# EAGLE design signal-a-2 (EAGLE 9.6.2)
AUTHOR: Balazs Racz; DRAWING_TITLE: MEB Schalterwerk Projekt; LICENSE: Licensed by the Solderpad Hardware License V2.0; REVIEWER: n/a; REVISION: A2; YEAR: 2023
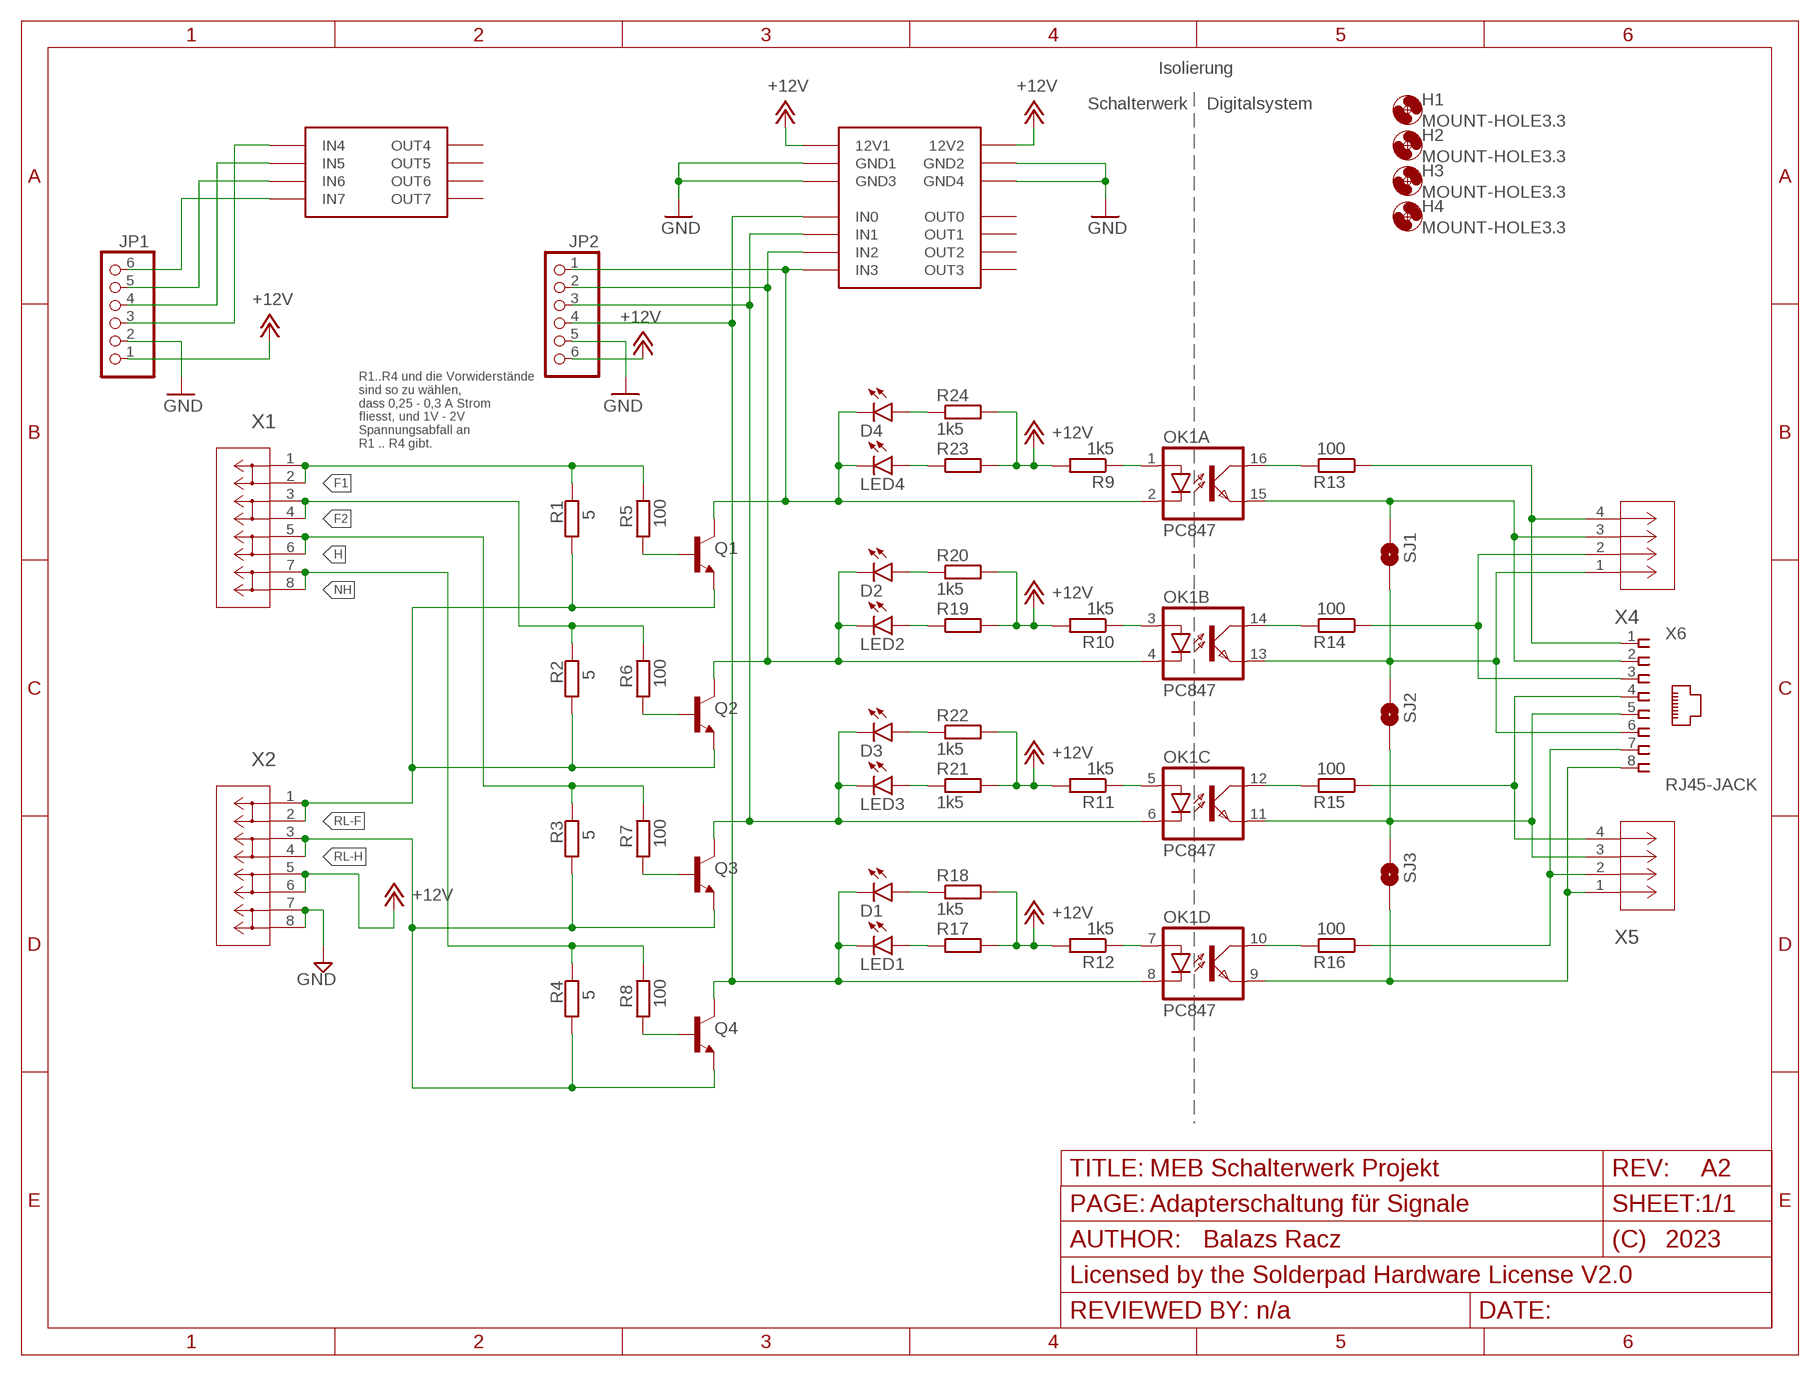
[diagram p0: schematic, sheet 1]
FRAME1 (FRAME_A_L): PAGE: Input ports
FRAME2 (FRAME_A_L): PAGE: Adapterschaltung für Signale

## Parts
D1  LEDHEADER  [LEDHEADER]
D2  LEDHEADER  [LEDHEADER]
D3  LEDHEADER  [LEDHEADER]
D4  LEDHEADER  [LEDHEADER]
H1  MOUNT-HOLE3.3  [3,3]
H2  MOUNT-HOLE3.3  [3,3]
H3  MOUNT-HOLE3.3  [3,3]
H4  MOUNT-HOLE3.3  [3,3]
JP1  PINHD-1X6-EDGE  [1X06]
JP2  PINHD-1X6-EDGE  [1X06]
LED1  LEDCHIPLED_0603  [CHIPLED_0603]
LED2  LEDCHIPLED_0603  [CHIPLED_0603]
LED3  LEDCHIPLED_0603  [CHIPLED_0603]
LED4  LEDCHIPLED_0603  [CHIPLED_0603]
OK1  PC847  [DIL16]
Q1  NPN-23  [SOT23]
Q2  NPN-23  [SOT23]
Q3  NPN-23  [SOT23]
Q4  NPN-23  [SOT23]
R1  5  R-EU_0617/22  [0617/22]
R2  5  R-EU_0617/22  [0617/22]
R3  5  R-EU_0617/22  [0617/22]
R4  5  R-EU_0617/22  [0617/22]
R5  100  R-EU_R0805  [R0805]
R6  100  R-EU_R0805  [R0805]
R7  100  R-EU_R0805  [R0805]
R8  100  R-EU_R0805  [R0805]
R9  1k5  R-EU_R0805  [R0805]
R10  1k5  R-EU_R0805  [R0805]
R11  1k5  R-EU_R0805  [R0805]
R12  1k5  R-EU_R0805  [R0805]
R13  100  R-EU_R0805  [R0805]
R14  100  R-EU_R0805  [R0805]
R15  100  R-EU_R0805  [R0805]
R16  100  R-EU_R0805  [R0805]
R17  1k5  R-EU_R0805  [R0805]
R18  1k5  R-EU_R0805  [R0805]
R19  1k5  R-EU_R0805  [R0805]
R20  1k5  R-EU_R0805  [R0805]
R21  1k5  R-EU_R0805  [R0805]
R22  1k5  R-EU_R0805  [R0805]
R23  1k5  R-EU_R0805  [R0805]
R24  1k5  R-EU_R0805  [R0805]
SJ1  SJRND2  [SJ_RND2]
SJ2  SJRND2  [SJ_RND2]
SJ3  SJRND2  [SJ_RND2]
X1  PHNX_4P_508CONN_1017493  [PHNX_4P_508]
X2  PHNX_4P_508CONN_1017493  [PHNX_4P_508]
X3  IO-HAT  [IOBOARD]
X4  PHNX_4P_350CONN_1984989_PXC  [PHNX_4P_350]
X5  PHNX_4P_350CONN_1984989_PXC  [PHNX_4P_350]
X6  RJ45-JACK  RJ45-JACKRJ45-PULSE-E5J00  [RJ45-PULSE-E5J88]

## Nets
+12V: JP1.1 JP2.6 R9.2 R10.2 R11.2 R12.2 R17.2 R18.2 R19.2 R20.2 R21.2 R22.2 R23.2 R24.2 X2.5 X2.6 X3.P$1(12V1) X3.P$22(12V2)
F1: R1.1 R5.2 X1.1 X1.2
F2: R2.1 R6.2 X1.3 X1.4
GND: JP1.2 JP2.5 X2.7 X2.8 X3.P$2(GND1) X3.P$11(GND3) X3.P$12(GND4) X3.P$21(GND2)
H: R3.1 R7.2 X1.5 X1.6
N$1: JP1.6 X3.P$10(IN7)
N$2: D1.C JP2.4 LED1.C OK1.8(D:C) Q4.3(C) X3.P$3(IN0)
N$3: JP1.5 X3.P$9(IN6)
N$4: JP1.4 X3.P$8(IN5)
N$5: D3.C JP2.3 LED3.C OK1.6(C:C) Q3.3(C) X3.P$4(IN1)
N$6: JP1.3 X3.P$7(IN4)
N$7: D2.C JP2.2 LED2.C OK1.4(B:C) Q2.3(C) X3.P$5(IN2)
N$8: LED1.A R17.1
N$9: D4.C JP2.1 LED4.C OK1.2(A:C) Q1.3(C) X3.P$6(IN3)
N$21: D1.A R18.1
N$22: Q1.1(B) R5.1
N$23: LED2.A R19.1
N$24: D2.A R20.1
N$25: LED3.A R21.1
N$27: D3.A R22.1
N$29: LED4.A R23.1
N$30: D4.A R24.1
N$31: OK1.1(A:A) R9.1
N$32: Q2.1(B) R6.1
N$34: OK1.3(B:A) R10.1
N$35: OK1.5(C:A) R11.1
N$36: OK1.7(D:A) R12.1
N$37: Q3.1(B) R7.1
N$39: Q4.1(B) R8.1
N$41: OK1.16(A:COL) R13.2
N$42: OK1.14(B:COL) R14.2
N$43: OK1.12(C:COL) R15.2
N$44: OK1.10(D:COL) R16.2
NH: R4.1 R8.2 X1.7 X1.8
NX41: R13.1 X4.4 X6.1
NX42: OK1.15(A:EMIT) SJ1.P$2 X4.3 X6.2
NX43: R14.1 X4.2 X6.3
NX44: R15.1 X5.4 X6.4
NX45: OK1.11(C:EMIT) SJ2.P$1 SJ3.P$2 X5.3 X6.5
NX46: OK1.13(B:EMIT) SJ1.P$1 SJ2.P$2 X4.1 X6.6
NX47: R16.1 X5.2 X6.7
NX48: OK1.9(D:EMIT) SJ3.P$1 X5.1 X6.8
RL-F: Q1.2(E) Q2.2(E) R1.2 R2.2 X2.1 X2.2
RL-H: Q3.2(E) Q4.2(E) R3.2 R4.2 X2.3 X2.4
Unconnected: X3.P$13(OUT7) X3.P$14(OUT6) X3.P$15(OUT5) X3.P$16(OUT4) X3.P$17(OUT3) X3.P$18(OUT2) X3.P$19(OUT1) X3.P$20(OUT0)

## Notes on the sheet
- Isolierung
- Schalterwerk | Digitalsystem
- R1..R4 und die Vorwiderstände
  sind so zu wählen,
  dass 0,25 - 0,3 A Strom
  fliesst, und 1V - 2V
  Spannungsabfall an
  R1 .. R4 gibt.

## Library data of the parts
D1-D4 = eagleparts:LEDHEADER
H1-H4 = holes:MOUNT-HOLE: MOUNTING HOLE with drill center marker
JP1 JP2 = eagleparts:PINHD-1X6-EDGE: PIN HEADER
LED1-LED4 = led:LED: LED OSRAM: - CHIPLED LG R971, LG N971, LY N971, LG Q971, LY Q971, LO R971, LY R971 LH N974, LH R974 LS Q976, LO Q976, LY Q976 LO Q996 - Hyper CHIPLED LW Q18S LB Q993, LB Q99A, LB R99A - SideLED LS A670, LO A670, LY A670, LG A670, LP A670 LB A673, LV A673, LT A673, LW A673 LH A674 LY A675 LS A676, LA A676, LO A676, LY A676, LW A676 LS A679, LY A679, LG A679 - Hyper Micro SIDELED® LS Y876, LA Y876, LO Y876, LY Y876 LT Y87S - SmartLED LW L88C, LW L88S LB L89C, LB L89S, LG L890 LS L89K, LO L89K, LY L89K LS L896, LA L896, LO L896, LY L896 - TOPLED LS T670, LO T670, LY T670, LG T670, LP T670 LSG T670, LSP T670, LSY T670, LOP T670, LYG T670 LG T671, LOG T671, LSG T671 LB T673, LV T673, LT T673, LW T673 LH T674 LS T676, LA T676, LO T676, LY T676, LB T676, LH T676, LSB T676, LW T676 LB T67C, LV T67C, LT T67C, LS T67K, LO T67K, LY T67K, LW E67C LS E67B, LA E67B, LO E67B, LY E67B, LB E67C, LV E67C, LT E67C LW T67C LS T679, LY T679, LG T679 LS T770, LO T770, LY T770, LG T770, LP T770 LB T773, LV T773, LT T773, LW T773 LH T774 LS E675, LA E675, LY E675, LS T675 LS T776, LA T776, LO T776, LY T776, LB T776 LHGB T686 LT T68C, LB T68C - Hyper Mini TOPLED® LB M676 - Mini TOPLED Santana® LG M470 LS M47K, LO M47K, LY M47K Source: http://www.osram.convergy.de LUXEON: - LUMILED® LXK2-PW12-R00, LXK2-PW12-S00, LXK2-PW14-U00, LXK2-PW14-V00 LXK2-PM12-R00, LXK2-PM12-S00, LXK2-PM14-U00 LXK2-PE12-Q00, LXK2-PE12-R00, LXK2-PE12-S00, LXK2-PE14-T00, LXK2-PE14-U00 LXK2-PB12-K00, LXK2-PB12-L00, LXK2-PB12-M00, LXK2-PB14-N00, LXK2-PB14-P00, LXK2-PB14-Q00 LXK2-PR12-L00, LXK2-PR12-M00, LXK2-PR14-Q00, LXK2-PR14-R00 LXK2-PD12-Q00, LXK2-PD12-R00, LXK2-PD12-S00 LXK2-PH12-R00, LXK2-PH12-S00 LXK2-PL12-P00, LXK2-PL12-Q00, LXK2-PL12-R00 Source: www.luxeon.com KINGBRIGHT: KA-3528ASYC Source: www.kingbright.com
OK1 = optocoupler:PC847: SHARP OPTO COUPLER; OC_FARNELL: 9707735; OC_NEWARK: unknown
Q1-Q4 = eagleparts:NPN-23
R1-R24 = rcl:R-EU_: RESISTOR, European symbol; SPICEPREFIX: R
SJ1-SJ3 = eagleparts:SJ: SMD solder JUMPER
X1 X2 = eagleparts:PHNX_4P_508: https://www.digikey.com/en/products/detail/phoenix-contact/1017505/9346606 DigiKey 277-17516-ND; COPYRIGHT: Copyright (C) 2023 Ultra Librarian. All rights reserved.; MANUFACTURER_PART_NUMBER: 1017505; MFR_NAME: Phoenix Contact
X3 = eagleparts:IO-HAT
X4 X5 = eagleparts:PHNX_4P_350: https://www.digikey.com/en/products/detail/phoenix-contact/1984989/2513979 DigiKey 277-6404-ND; COPYRIGHT: Copyright (C) 2023 Ultra Librarian. All rights reserved.; MANUFACTURER_PART_NUMBER: 1984989; MFR_NAME: Phoenix Contact
X6 = trainlib:RJ45-JACK: Mod. Jack, Right Angle, 8 posiotion, 8 contatcs RJ45 Source: GLX-S-88M.pdf

## Board
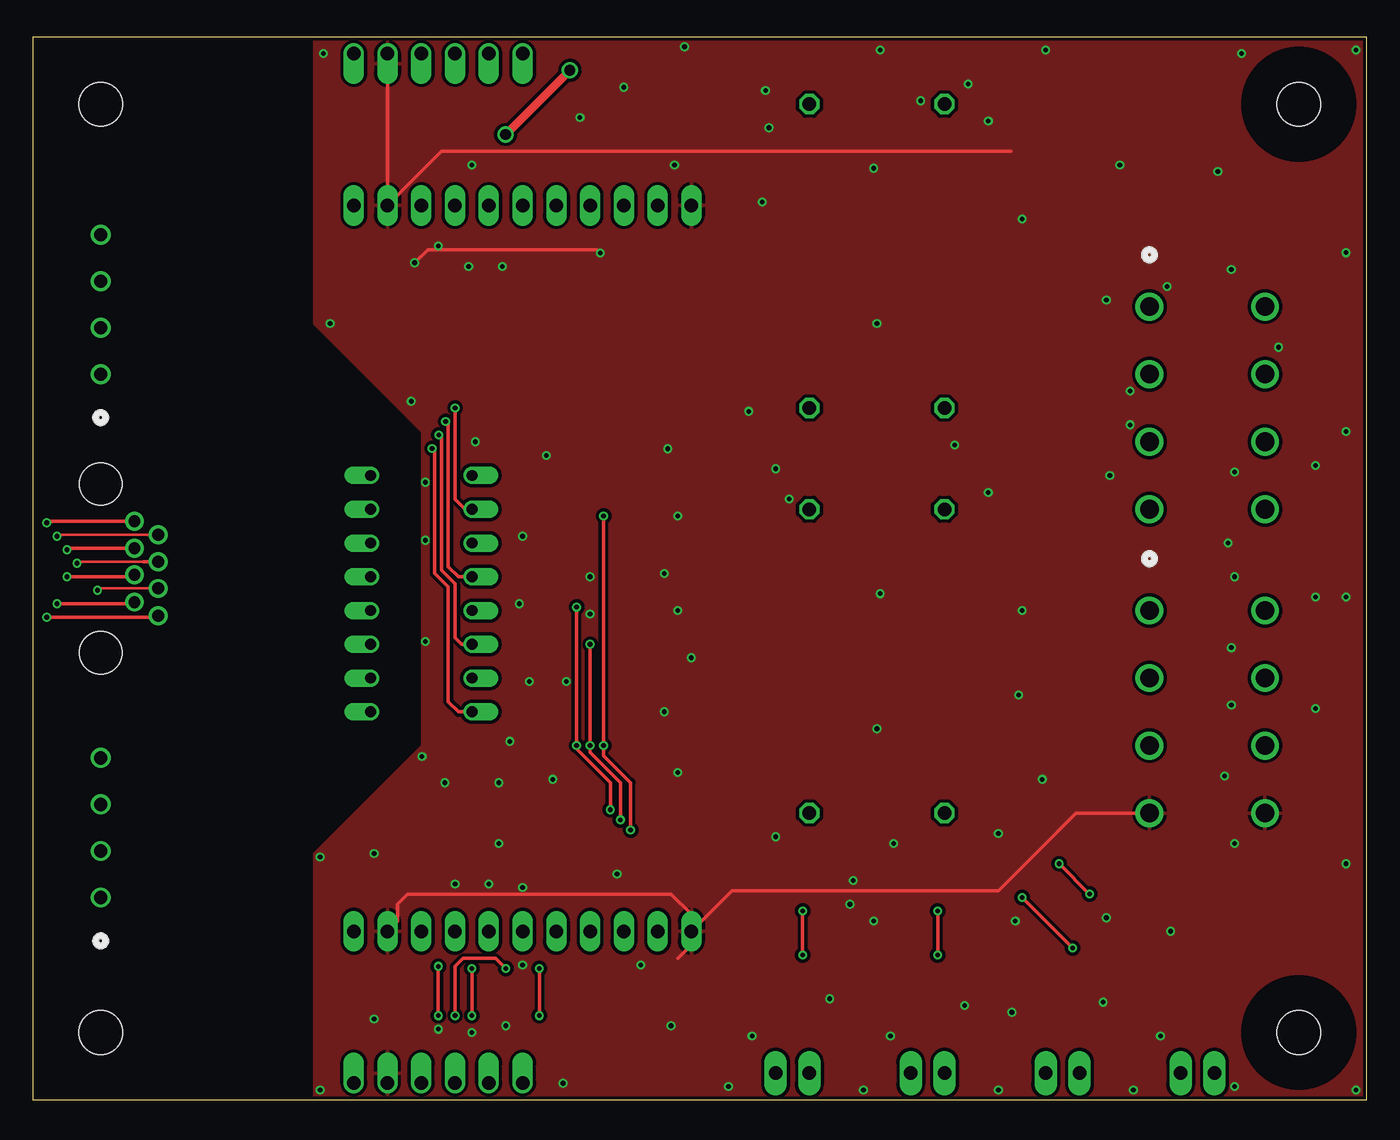
[diagram p1: board, top side]
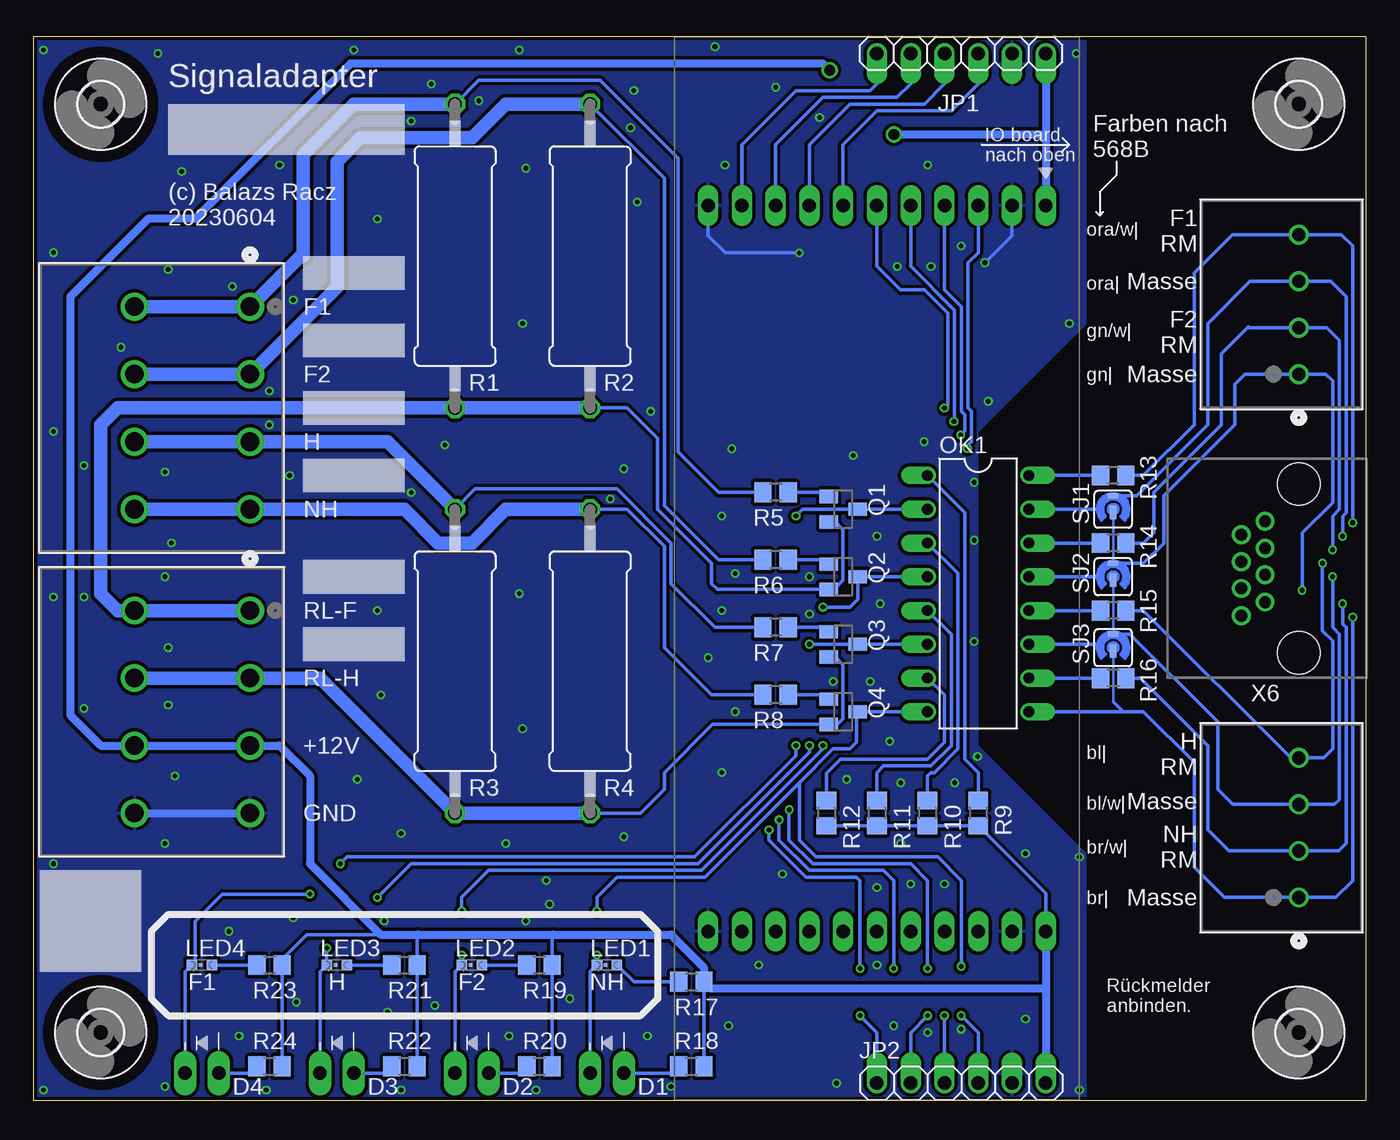
[diagram p2: board, bottom side, seen from below]

Size 100.33 x 80.01 mm. Coordinates in mm from the lower left corner, seen from the top.
Outline: 100.33,0 0,0 0,80.01 100.33,80 100.33,0
Copper layers (1*16): Top 0.035mm / dielectric 1.5mm / Bottom 0.035mm
Design rules "SeeedStudio_2layer_DRU_no_angle_20140221": minimum track width 6mil, minimum drill 12mil, track to track 6mil, track to pad 6mil, pad to pad 6mil, via to via 6mil, smd to smd 0mil, copper to edge 10mil, drill to drill 10mil, minimum pad ring 10mil, minimum via ring 6mil, stop-mask expansion 2mil, vias tented up to drill 100mil, thermal gap 10mil

### Footprints (pad centres in the part's own frame; a part is rotated, then mirrored left to right if it is on the bottom)
LEDHEADER = drill 1.016 pad 1.676 long: A -1.27,0; C 1.27,0
3,3 = hole 3.3: 0,0
1X06 = drill 1.016 offset: 1 -6.35,0; 2 -3.81,0; 3 -1.27,0; 4 1.27,0; 5 3.81,0; 6 6.35,0
CHIPLED_0603 = smd 0.8 x 0.8: A 0,-0.75; C 0,0.75
DIL16 = drill 0.813 offset: 1 -8.89,-3.81; 2 -6.35,-3.81; 3 -3.81,-3.81; 4 -1.27,-3.81; 5 1.27,-3.81; 6 3.81,-3.81; 7 6.35,-3.81; 8 8.89,-3.81; 9 8.89,3.81; 10 6.35,3.81; 11 3.81,3.81; 12 1.27,3.81; 13 -1.27,3.81; 14 -3.81,3.81; 15 -6.35,3.81; 16 -8.89,3.81
SOT23 = smd 1 x 1.4: 1 -0.95,-1.1; 2 0.95,-1.1; 3 0,1.1
0617/22 = drill 1.016 octagon: 1 -11.43,0; 2 11.43,0
R0805 = smd 1.3 x 1.5: 1 -0.95,0; 2 0.95,0
SJ_RND2 = smd 1.016 x 0.508: P$1 -0.254,0 | smd 0.406 x 0.813: P$2 1.016,0
PHNX_4P_508 = drill 1.397 pad 1.905: 1 -15.24,8.7; 2 -15.24,0; 3 -10.16,8.7; 4 -10.16,0; 5 -5.08,8.7; 6 -5.08,0; 7 0,8.7; 8 0,0
IOBOARD = drill 1.016 pad 1.524 long: P$1 12.7,27.94; P$2 12.7,25.4; P$3 12.7,22.86; P$4 12.7,20.32; P$5 12.7,17.78; P$6 12.7,15.24; P$7 12.7,12.7; P$8 12.7,10.16; P$9 12.7,7.62; P$10 12.7,5.08; P$11 12.7,2.54; P$12 67.31,2.54; P$13 67.31,5.08; P$14 67.31,7.62; P$15 67.31,10.16; P$16 67.31,12.7; P$17 67.31,15.24; P$18 67.31,17.78; P$19 67.31,20.32; P$20 67.31,22.86; P$21 67.31,25.4; P$22 67.31,27.94
PHNX_4P_350 = drill 0.991 pad 1.499: 1 0,0; 2 3.5,0; 3 7,0; 4 10.5,0
RJ45-PULSE-E5J88 = drill 0.9 pad 1.422: 1 3.555,2.54; 2 2.535,4.32; 3 1.515,2.54; 4 0.495,4.32; 5 -0.495,2.54; 6 -1.515,4.32; 7 -2.535,2.54; 8 -3.555,4.32 | hole 3.2: 6.35,0; -6.35,0

### Placement (x,y rotation side)
D1  57.15,2.02 180 bottom
D2  67.31,2.02 180 bottom
D3  77.47,2.02 180 bottom
D4  87.63,2.02 180 bottom
H1  5.08,74.93 0 bottom
H2  5.08,5.08 0 bottom
H3  95.25,5.08 0 bottom
H4  95.25,74.93 0 bottom
JP1  30.48,78.74 180 bottom
JP2  30.48,1.27 0 bottom
LED1  57.15,10.16 90 bottom
LED2  67.31,10.16 90 bottom
LED3  77.47,10.16 90 bottom
LED4  87.63,10.16 90 bottom
OK1  29.21,38.1 270 bottom
Q1  39.37,44.45 270 bottom
Q2  39.37,39.37 270 bottom
Q3  39.37,34.29 270 bottom
Q4  39.37,29.21 270 bottom
R1  68.58,63.5 270 bottom
R2  58.42,63.5 270 bottom
R3  68.58,33.02 270 bottom
R4  58.42,33.02 270 bottom
R5  44.45,45.72 180 bottom
R6  44.45,40.64 180 bottom
R7  44.45,35.56 180 bottom
R8  44.45,30.48 180 bottom
R9  29.21,21.59 270 bottom
R10  33.02,21.59 270 bottom
R11  36.83,21.59 270 bottom
R12  40.64,21.59 270 bottom
R13  19.05,46.99 180 bottom
R14  19.05,41.91 180 bottom
R15  19.05,36.83 180 bottom
R16  19.05,31.75 180 bottom
R17  50.8,8.89 0 bottom
R18  50.8,2.54 0 bottom
R19  62.23,10.16 0 bottom
R20  62.23,2.54 0 bottom
R21  72.39,10.16 0 bottom
R22  72.39,2.54 0 bottom
R23  82.55,10.16 0 bottom
R24  82.55,2.54 0 bottom
SJ1  19.05,44.45 90 bottom
SJ2  19.05,39.37 90 bottom
SJ3  19.05,34.04 90 bottom
X1  92.71,44.45 270 bottom
X2  92.71,21.59 270 bottom
X3  52.07,80.01 270 bottom
X4  5.08,54.61 90 bottom
X5  5.08,15.24 90 bottom
X6  5.08,40.01 90 bottom

### Tracks (layer width: path | path; a pad name or v marks a point on that pad's centre or on a via)
+12V  (via drill 0.81)
  Top 0.61: v35.56,72.64 v40.39,77.47
  Bottom 0.254: R24.2 R23.2 81.6,10.6 79.76,12.45 74.17,12.45 | R20.2 R19.2 61.28,12.38 61.21,12.45 | R22.2 R21.2 71.44,12.38 71.37,12.45 | R17.2 R18.2 | R12.2 R11.2 R10.2 R9.2 24.13,15.56 X3.P$22
  Bottom 0.61: 24.13,8.38 49.34,8.38 R17.2 49.85,9.97 52.32,12.45 61.21,12.45 71.37,12.45 74.17,12.45 79.5,17.78 79.5,24.38 81.79,26.67 X2.5 X2.6 95.25,26.67 97.54,28.96 97.54,60.45 91.69,66.29 88.14,66.29 76.45,77.98 40.89,77.98 v40.39,77.47 | JP1.1 24.13,72.64 | 24.13,72.64 X3.P$1 | 24.13,72.64 v35.56,72.64 | 24.13,8.38 JP2.6 | X3.P$22 24.13,8.38
F1
  Bottom 0.254: R5.2 48.77,45.72 51.82,48.77 51.82,70.87 57.66,76.71 66.8,76.71 R1.1
  Bottom 1.016: X1.2 X1.1 80.2,63.5 80.01,63.5 80.01,71.12 76.2,74.93 R1.1
F2
  Bottom 0.254: R2.1 52.83,69.34 52.83,44.7 48.77,40.64 R6.2
  Bottom 1.016: X1.4 X1.3 77.47,61.15 77.47,70.61 75.69,72.39 67.31,72.39 64.77,74.93 R2.1
GND  (via drill 0.35)
  Top 0.254: 73.6,71.37 30.73,71.37 X3.P$2 JP1.2 | v42.67,63.74 42.42,63.99 29.7,63.99 v28.7,62.99 | X2.7 78.49,21.59 72.64,15.75 52.58,15.75 X3.P$12 | X3.P$12 49.53,11.68 48.51,10.67 | X3.P$21 27.43,13.46 27.43,14.73 28.19,15.49 48.01,15.49 49.53,13.97 X3.P$12
  Bottom 0.254: X3.P$2 26.67,65.02 v28.7,62.99 | X3.P$11 49.53,65.02 48.24,63.74 v42.67,63.74
  Bottom 0.61: X2.8 X2.7
  other vias: 90.93,78.74 89.15,69.85 76.2,78.99 63.75,78.99 49.02,79.25 44.45,76.2 33.02,70.36 48.26,70.36 21.84,78.74 41.15,73.91 82.55,50.8 35.88,26.99 35.05,19.3 61.47,14.73 63.25,13.46 73.91,13.46 80.77,13.72 85.6,12.7 90.42,19.3 84.84,4.83 73.66,6.6 80.52,7.37 70.1,7.11 64.52,4.83 59.94,7.62 54.1,4.83 48.01,5.59 61.72,16.51 35.56,5.59 39.88,1.27 25.65,6.1 25.65,18.54 89.66,24.38 90.17,29.72 90.17,34.04 90.42,39.37 90.42,47.24 93.73,56.64 90.17,62.48 81.79,70.36 80.77,60.2 85.34,61.21 35.05,23.88 39.12,24.13 30.99,23.88 37.34,31.5 36.58,37.34 36.83,42.42 48.51,43.94 47.5,39.62 41.91,39.37 41.91,36.58 48.51,36.83 49.53,33.27 40.13,31.5 47.5,29.21 63.75,38.1 63.5,27.94 55.88,47.5 69.34,49.28 71.88,45.72 81.03,46.99 74.17,30.48 74.42,36.83 89.92,41.91 75.95,24.13 72.64,20.07 55.88,19.81 64.77,19.3 48.51,24.64 43.94,17.02 45.72,10.16 28.45,52.58 22.35,58.42 33.27,49.53 29.51,46.48 29.51,42.11 29.51,34.49 29.26,25.86 21.59,18.29 21.59,0.76 52.32,1.02 62.48,0.76 72.64,0.76 82.8,0.76 90.42,1.02 99.57,0.76 98.81,17.78 98.81,37.85 98.81,50.29 98.81,63.75 99.57,78.99 74.42,66.29 63.25,70.1 63.5,58.42 82.55,53.34 53.85,51.82 54.86,67.56 47.75,49.01 38.61,48.5 33.02,5.08 30.48,5.33 36.83,16 34.29,16.26 31.75,16.26 36.83,10.16 70.36,76.45 66.8,75.18 55.12,75.95 96.52,37.85 96.52,47.75 96.52,29.46 56.9,45.21 55.37,73.15 71.88,73.66 35.31,62.72 32.77,62.72 30.48,64.25
  pour Bottom (isolate 0.254): 100.08,79.76 100.08,0.25 21.08,0.25 21.08,18.54 29.21,26.67 29.21,50.29 21.08,58.42 21.08,79.76
  pour Top (isolate 0.254): 100.08,0.25 100.08,79.76 21.08,79.76 21.08,58.42 29.21,50.29 29.21,26.67 21.08,18.54 21.08,0.25
H
  Bottom 0.254: R3.1 67.06,45.97 56.39,45.97 52.32,41.91 52.32,38.86 49.02,35.56 R7.2
  Bottom 1.016: X1.6 X1.5 73.66,49.53 R3.1
N$1
  Bottom 0.254: X3.P$10 46.99,71.88 42.93,75.95 37.34,75.95 36.83,76.45 JP1.6
N$2  (via drill 0.35)
  Top 0.254: v30.02,49.02 30.23,48.82 30.23,39.62 31.24,38.61 31.24,29.97 32,29.21 OK1.8 | v57.91,14.22 v57.91,10.92 | v30.48,10.06 v30.48,6.35
  Bottom 0.254: X3.P$3 29.21,63.75 29.97,62.99 29.97,52.07 29.72,51.82 29.72,49.53 30.02,49.23 v30.02,49.02 | LED1.C 57.91,10.15 | 57.91,10.15 58.42,9.64 D1.C | OK1.8 Q4.3 38.35,29.13 38.35,26.92 38.86,26.42 40.13,26.42 42.67,23.88 | v57.91,14.22 57.91,15.24 56.39,16.76 49.78,16.76 42.67,23.88 | v57.91,10.92 57.91,10.15 | 42.67,23.88 42.67,19.56 41.4,18.29 32.26,18.29 30.48,16.51 v30.48,10.06 | v30.48,6.35 29.21,5.08 JP2.4
N$3
  Bottom 0.254: X3.P$9 44.45,71.88 40.89,75.44 35.31,75.44 34.29,76.45 JP1.5
N$4
  Bottom 0.254: X3.P$8 41.91,71.88 38.86,74.93 33.27,74.93 31.75,76.45 JP1.4
N$5  (via drill 0.35)
  Top 0.254: OK1.6 32.26,34.29 31.75,34.8 31.75,38.86 30.73,39.88 30.73,49.84 v30.53,50.04 | v78.23,11.43 v74.42,15.24 | v41.91,34.29 v41.91,26.67 41.91,26.16 44.2,23.88 v44.2,21.08 | v31.75,6.35 31.75,10.06 32.36,10.67 34.8,10.67 v35.56,9.91
  Bottom 0.254: X3.P$4 31.75,60.96 30.48,59.69 30.48,51.82 30.23,51.56 30.23,50.34 v30.53,50.04 | D3.C 78.74,9.64 LED3.C 78.23,10.17 v78.23,11.43 | OK1.6 Q3.3 v41.91,34.29 | v74.42,15.24 71.88,17.78 50.29,17.78 41.91,26.16 v41.91,26.67 | JP2.3 v31.75,6.35 | v44.2,21.08 44.2,19.56 41.91,17.27 36.32,17.27 35.56,16.51 v35.56,9.91
N$6
  Bottom 0.254: X3.P$7 39.37,71.88 36.83,74.42 31.24,74.42 29.21,76.45 JP1.3
N$7  (via drill 0.35)
  Top 0.254: v31.04,51.05 31.24,50.85 31.24,40.13 32,39.37 OK1.4 | v68.07,10.92 v68.07,14.22 | v40.89,37.08 v40.89,26.67 40.89,26.42 43.43,23.88 v43.43,21.84 | v33.02,6.35 v33.02,9.91
  Bottom 0.254: X3.P$5 34.29,62.74 30.99,59.44 30.99,51.1 v31.04,51.05 | D2.C 68.58,9.64 LED2.C v68.06,10.91 v68.07,10.92 | OK1.4 Q2.3 38.27,37.68 38.86,37.08 v40.89,37.08 | v68.07,14.22 68.07,15.24 66.04,17.27 50.04,17.27 40.89,26.42 v40.89,26.67 | JP2.2 34.29,5.08 v33.02,6.35 | v33.02,9.91 33.02,16.51 34.29,17.78 41.66,17.78 43.43,19.56 v43.43,21.84
N$8
  Bottom 0.254: R17.1 55.13,8.89 LED1.A
N$9  (via drill 0.35)
  Top 0.254: v31.75,52.07 31.75,45.21 32.51,44.45 OK1.2 | v79.5,15.49 v77.22,17.78 | v42.93,43.94 v42.93,26.67 42.93,25.91 44.96,23.88 v44.96,20.32 | v38.1,9.91 v38.1,6.35
  Bottom 0.254: X3.P$6 36.83,62.74 35.05,60.96 33.27,60.96 31.5,59.18 31.5,52.32 v31.75,52.07 | D4.C 88.9,9.64 LED4.C 88.14,10.4 88.14,13.46 86.11,15.49 v79.5,15.49 | OK1.2 Q1.3 42.42,44.45 v42.93,43.94 | v77.22,17.78 76.71,18.29 50.55,18.29 42.93,25.91 v42.93,26.67 | JP2.1 36.83,5.08 v38.1,6.35 | v38.1,9.91 38.1,16.51 38.35,16.76 42.16,16.76 44.96,19.56 v44.96,20.32
N$21
  Bottom 0.254: R18.1 52.27,2.02 D1.A
N$22
  Bottom 0.254: R5.1 40.79,45.72 Q1.1
N$23
  Bottom 0.254: R19.1 LED2.A
N$24
  Bottom 0.254: R20.1 63.7,2.02 D2.A
N$25
  Bottom 0.254: R21.1 LED3.A
N$27
  Bottom 0.254: R22.1 73.86,2.02 D3.A
N$29
  Bottom 0.254: R23.1 LED4.A
N$30
  Bottom 0.254: R24.1 84.02,2.02 D4.A
N$31
  Bottom 0.254: OK1.1 30.23,44.2 30.23,25.65 29.21,24.64 R9.1
N$32
  Bottom 0.254: R6.1 40.79,40.64 Q2.1
N$34
  Bottom 0.254: R10.1 33.02,24.38 32.77,24.64 32.51,24.64 30.73,26.42 30.73,39.62 OK1.3
N$35
  Bottom 0.254: R11.1 36.83,24.64 36.32,25.15 32.77,25.15 31.24,26.67 31.24,35.05 OK1.5
N$36
  Bottom 0.254: R12.1 40.64,24.57 39.56,25.65 33.02,25.65 31.75,26.92 31.75,30.48 OK1.7
N$37
  Bottom 0.254: R7.1 40.79,35.56 Q3.1
N$39
  Bottom 0.254: R8.1 40.79,30.48 Q4.1
N$41
  Bottom 0.254: R13.2 OK1.16
N$42
  Bottom 0.254: R14.2 OK1.14
N$43
  Bottom 0.254: R15.2 OK1.12
N$44
  Bottom 0.254: R16.2 OK1.10
NH
  Bottom 0.254: R4.1 55.63,44.45 52.83,41.66 52.83,34.04 49.28,30.48 R8.2
  Bottom 1.016: X1.8 X1.7 72.39,44.45 69.85,41.91 67.31,41.91 64.77,44.45 R4.1
NX41  (via drill 0.35)
  Top 0.254: v1.02,43.43 1.14,43.56 X6.1
  Bottom 0.254: v1.02,43.43 1.02,64.26 1.86,65.11 X4.4 10.07,65.11 12.95,62.23 12.95,50.8 16.76,46.99 R13.1
NX42  (via drill 0.35)
  Top 0.203: X6.2 1.9,42.54
  Top 0.254: 1.9,42.54 v1.78,42.42
  Bottom 0.254: v1.78,42.42 1.78,43.94 1.52,44.2 1.52,60.45 2.68,61.61 X4.3 8.75,61.61 11.94,58.42 11.94,50.8 17.27,45.47 SJ1.P$2 19.56,45.47 19.81,45.21 19.81,44.7 20.07,44.45 OK1.15
NX43  (via drill 0.35)
  Top 0.254: X6.3 2.66,41.52 v2.54,41.4
  Bottom 0.254: v2.54,41.4 2.54,43.94 2.03,44.45 2.03,57.15 2.99,58.11 X4.2 8.83,58.11 8.89,58.17 10.92,56.13 10.92,50.8 16,45.72 16,42.67 16.76,41.91 R14.1
NX44  (via drill 0.35)
  Top 0.203: 3.42,40.5 8.28,40.5
  Top 0.254: 3.42,40.5 v3.3,40.39 | 8.28,40.5 X6.4
  Bottom 0.254: v3.3,40.39 3.3,35.31 2.54,34.54 2.54,26.42 3.22,25.74 X5.4 5.67,25.74 16.76,36.83 R15.1
NX45  (via drill 0.35)
  Top 0.254: v2.54,39.37 7.48,39.37 X6.5
  Bottom 0.203: SJ3.P$2 SJ2.P$1
  Bottom 0.254: v2.54,39.37 2.54,35.56 2.03,35.05 2.03,22.61 2.4,22.24 X5.3 10.05,22.24 11.18,23.37 11.18,28.45 17.78,35.05 SJ3.P$2 19.56,35.05 20.07,34.54 20.07,34.29 OK1.11
NX46  (via drill 0.35)
  Top 0.203: X6.6 4.96,38.49
  Top 0.254: 4.96,38.49 v4.83,38.35
  Bottom 0.203: SJ2.P$2 SJ1.P$1
  Bottom 0.254: v4.83,38.35 4.83,42.67 2.54,44.96 2.54,54.1 3.05,54.61 X4.1 9.14,54.61 9.91,53.85 9.91,50.8 15.24,45.47 15.24,41.91 16.76,40.39 SJ2.P$2 19.3,40.13 19.81,40.13 20.07,39.88 20.07,39.37 OK1.13
NX47  (via drill 0.35)
  Top 0.254: v1.78,37.34 7.49,37.34 X6.7
  Bottom 0.254: v1.78,37.34 1.78,35.81 1.52,35.56 1.52,19.3 2.09,18.74 X5.2 10.36,18.74 11.94,20.32 11.94,26.67 17.02,31.75 R16.1
NX48  (via drill 0.35)
  Top 0.254: v1.02,36.32 9.27,36.32 X6.8
  Bottom 0.203: 19.05,29.97 SJ3.P$1
  Bottom 0.254: v1.02,36.32 1.02,16.51 2.29,15.24 X5.1 10.67,15.24 12.95,17.53 12.95,25.4 16.76,29.21 18.29,29.21 | 18.29,29.21 19.05,29.97 | 18.29,29.21 OK1.9
RL-F
  Bottom 0.254: Q1.2 39.94,43.5 39.37,42.93 39.37,39.12 40.07,38.42 Q2.2 48.83,38.42 49.28,38.86 49.28,40.39 53.34,44.45 53.34,49.78 55.63,52.07 R2.2
  Bottom 1.016: R2.2 R1.2 93.98,52.07 95.25,50.8 95.25,38.1 93.98,36.83 X2.2 X2.1
RL-H
  Bottom 0.254: Q3.2 39.94,33.34 39.37,32.77 39.37,28.7 39.81,28.26 Q4.2 49.21,28.26 52.83,24.64 52.83,23.37 54.61,21.59 R4.2
  Bottom 1.016: R4.2 R3.2 78.74,31.75 X2.3 X2.4

### Text on the board
bPlace: IO board / nach oben | Rückmelder / anbinden.
bNames: Signaladapter | Farben nach / 568B | (c) Balazs Racz / 20230604 | F1 / RM | ora/w| | Masse | ora| | F1 | F2 / RM | gn/w| | Masse | F2 | gn| | H | NH | RL-F | RL-H | +12V | H / RM | bl| | Masse | bl/w| | GND | NH / RM | br/w| | Masse | br| | NH | F2 | H | F1